# EAGLE design MICROCONTROLLER_SAI (EAGLE 9.6.2)
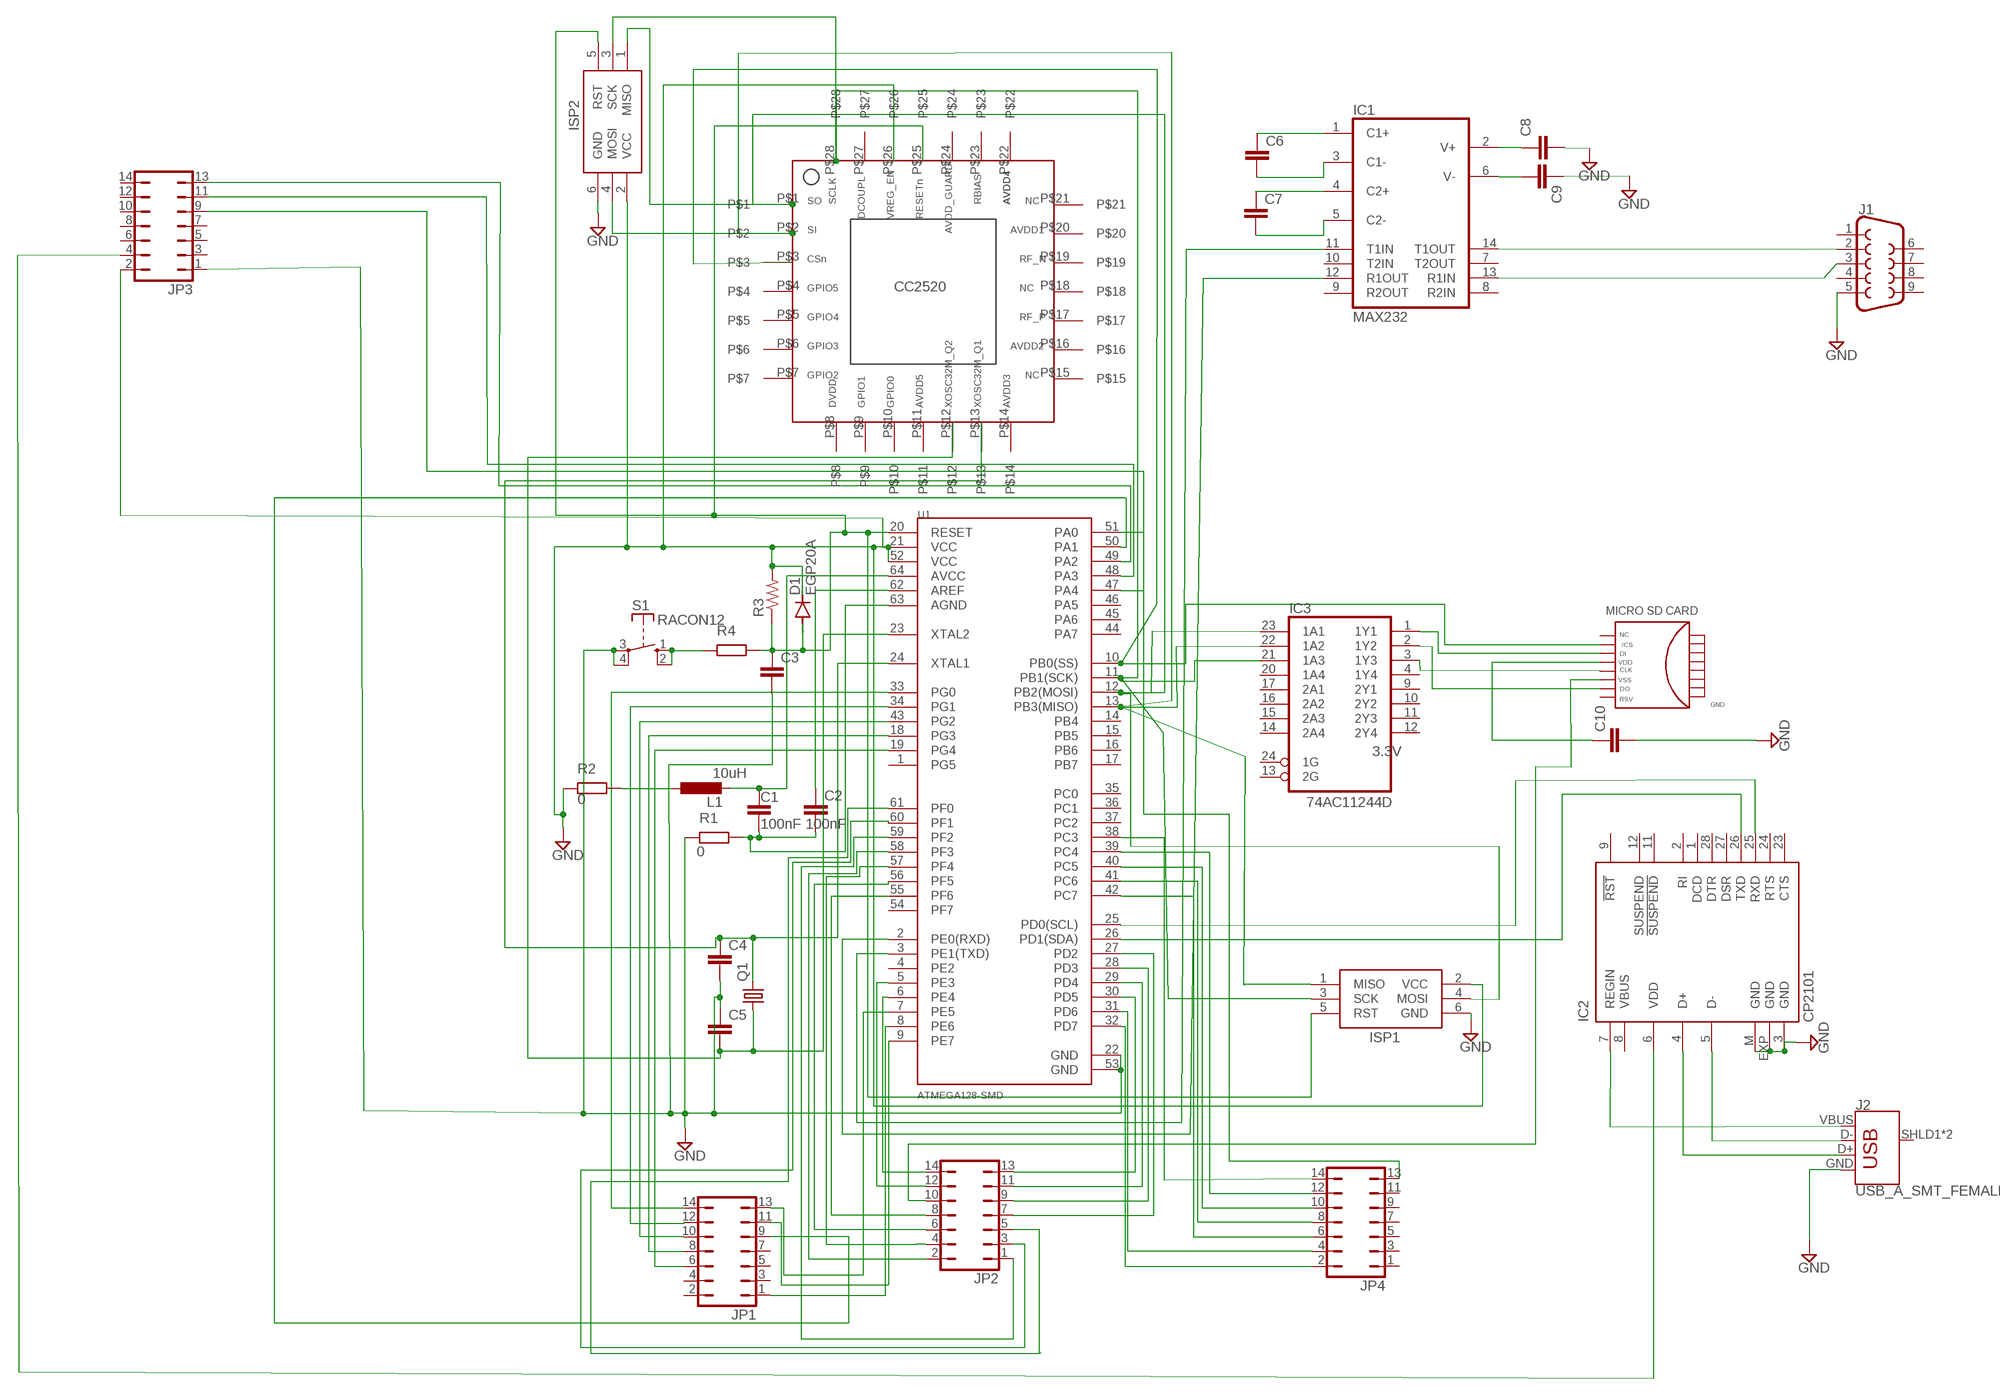
[diagram p0: schematic, sheet 1]

## Parts
C1  C2,5-3  [C2.5-3]
C2  C2,5-3  [C2.5-3]
C3  C7.5/3  [C7.5B3]
C4  C2,5-3  [C2.5-3]
C5  C2,5-3  [C2.5-3]
C6  C7.5/3  [C7.5B3]
C7  C7.5/3  [C7.5B3]
C8  C7.5/3  [C7.5B3]
C9  C7.5/3  [C7.5B3]
C10  C7.5/3  [C7.5B3]
D1  EGP20A  [DO15-12]
IC1  MAX232  [DIL16]
IC2  CP2101  [MLP28]
IC3  74AC11244D  [SO24W]
ISP1  AVRISP-6  [AVRISP]
ISP2  AVRISP-6  [AVRISP]
J1  DB9FEMALE  [DB9]
J2  USB_A_SMT_FEMALE  [USB-A-S-SILK-FEMALE]
JP1  JP7Q  [JP7Q]
JP2  JP7Q  [JP7Q]
JP3  JP7Q  [JP7Q]
JP4  JP7Q  [JP7Q]
L1  L-EU0204/5  [0204/5]
Q1  CRYSTALHC49U-V  [HC49U-V]
R1  R  (no package)
R2  R  (no package)
R3  R-US_VTA55  [VTA55]
R4  R  (no package)
S1  RACON12  [RACON12]
U1  ATMEGA128-SMD  [TQFP64_14X14MM]
U$1  SD-CARD  [SD-CARD]
U$2  CC2520  [CC2520]

## Nets
3.3V: C10.1 U$1.P$4
5V: C3.2 C4.2 C5.1 D1.C ISP1.2(VCC) ISP2.2(VCC) JP3.1 JP3.2 R1.1 R2.1 R3.2 S1.3(P) S1.4(P) U1.21(VCC) U1.22(GND) U1.52(VCC) U1.53(GND) U$2.P$26 ; supply symbol labelled GND
GND: C8.2 C9.1 C10.2 IC2.3(GND) IC2.EXP(GND) IC2.M(GND) ISP1.6(GND) ISP2.6(GND) J1.5 J2.GND
N$1: C2.1 U1.62(AREF)
N$2: C1.2 C2.2 R1.2 U1.63(AGND)
N$3: C1.1 L1.2 U1.64(AVCC)
N$4: L1.1 R2.2
N$5: R4.1 S1.1(S) S1.2(S)
N$6: C6.1 IC1.1(C1+)
N$7: U1.10(PB0(SS)) U$1.P$2 U$2.P$3
N$8: C4.1 Q1.2 U1.24(XTAL1) U$2.P$13
N$9: C5.2 Q1.1 U1.23(XTAL2) U$2.P$12
N$10: IC3.22(1A2) ISP1.1(MISO) ISP2.4(MOSI) U1.13(PB3(MISO)) U$2.P$2
N$11: IC3.23(1A1) ISP1.4(MOSI) ISP2.1(MISO) U1.12(PB2(MOSI)) U$2.P$1
N$12: IC3.21(1A3) ISP1.3(SCK) ISP2.3(SCK) U1.11(PB1(SCK)) U$2.P$28
N$13: C9.2 IC1.6(V-)
N$14: C8.1 IC1.2(V+)
N$15: C7.1 IC1.4(C2+)
N$16: C6.2 IC1.3(C1-)
N$17: C7.2 IC1.5(C2-)
N$18: IC2.25(RXD) U1.25(PD0(SCL))
N$19: IC1.11(T1IN) U1.3(PE1(TXD))
N$20: IC1.12(R1OUT) U1.2(PE0(RXD))
N$21: IC3.3(1Y3) U$1.P$5
N$22: JP2.5 U1.61(PF0)
N$23: IC2.5(D-) J2.D-
N$24: JP2.3 U1.60(PF1)
N$25: IC2.4(D+) J2.D+
N$26: IC2.7(REGIN) J2.VBUS
N$27: IC1.14(T1OUT) J1.2
N$28: IC1.13(R1IN) J1.3
N$29: C3.1 D1.A ISP1.5(RST) ISP2.5(RST) R3.1 R4.2 U1.20(RESET) U$2.P$25
N$30: IC2.26(TXD) U1.26(PD1(SDA))
N$31: IC3.1(1Y1) U$1.P$3
N$32: IC3.2(1Y2) U$1.P$7
N$33: JP2.12 U1.5(PE3)
N$34: JP2.14 U1.6(PE4)
N$35: JP4.2 U1.32(PD7)
N$36: JP4.4 U1.31(PD6)
N$37: JP4.12 U1.39(PC4)
N$38: JP4.10 U1.40(PC5)
N$39: JP4.8 U1.41(PC6)
N$40: JP4.6 U1.42(PC7)
N$41: JP4.13 U1.51(PA0)
N$42: JP1.11 U1.9(PE7)
N$43: JP1.1 U1.8(PE6)
N$44: JP1.13 U1.7(PE5)
N$45: JP1.9 U1.50(PA1)
N$46: JP4.14 U1.38(PC3)
N$48: JP1.14 U1.33(PG0)
N$49: JP1.12 U1.34(PG1)
N$50: JP1.10 U1.43(PG2)
N$51: JP1.8 U1.18(PG3)
N$52: JP1.6 U1.19(PG4)
N$53: JP2.13 U1.30(PD5)
N$54: JP2.11 U1.29(PD4)
N$55: JP2.9 U1.28(PD3)
N$56: JP2.7 U1.27(PD2)
N$57: JP2.1 U1.59(PF2)
N$58: JP2.2 U1.58(PF3)
N$59: JP2.4 U1.57(PF4)
N$60: JP2.6 U1.56(PF5)
N$61: JP2.8 U1.55(PF6)
N$62: JP2.10 U$1.P$6
N$63: JP3.13 U1.49(PA2)
N$64: JP3.11 U1.48(PA3)
N$65: JP3.9 U1.47(PA4)
N$67: IC2.6(VDD) JP3.4
Unconnected: IC1.7(T2OUT) IC1.8(R2IN) IC1.9(R2OUT) IC1.10(T2IN) IC2.1(DCD) IC2.2(RI) IC2.8(VBUS) IC2.9(!RST) IC2.11(!SUSPEND) IC2.12(SUSPEND) IC2.23(CTS) IC2.24(RTS) IC2.27(DSR) IC2.28(DTR) IC3.4(1Y4) IC3.9(2Y1) IC3.10(2Y2) IC3.11(2Y3) IC3.12(2Y4) IC3.13(2G) IC3.14(2A4) IC3.15(2A3) IC3.16(2A2) IC3.17(2A1) IC3.20(1A4) IC3.24(1G) J1.1 J1.4 J1.6 J1.7 J1.8 J1.9 J2.SHLD1(SHIELD) J2.SHLD2(SHIELD) JP1.2 JP1.3 JP1.4 JP1.5 JP1.7 JP3.3 JP3.5 JP3.6 JP3.7 JP3.8 JP3.10 JP3.12 JP3.14 JP4.1 JP4.3 JP4.5 JP4.7 JP4.9 JP4.11 U1.1(PG5) U1.4(PE2) U1.14(PB4) U1.15(PB5) U1.16(PB6) U1.17(PB7) U1.35(PC0) U1.36(PC1) U1.37(PC2) U1.44(PA7) U1.45(PA6) U1.46(PA5) U1.54(PF7) U$1.P$1 U$1.P$8 U$1.P$9 U$1.P$10 U$1.P$11 U$1.P$12 U$1.P$13 U$1.P$14 U$1.P$15 U$1.P$16 U$2.P$4 U$2.P$5 U$2.P$6 U$2.P$7 U$2.P$8 U$2.P$9 U$2.P$10 U$2.P$11 U$2.P$14 U$2.P$15 U$2.P$16 U$2.P$17 U$2.P$18 U$2.P$19 U$2.P$20 U$2.P$21 U$2.P$22 U$2.P$23 U$2.P$24 U$2.P$27

## Notes on the sheet
- 10uH
- 0
- 100nF | 100nF
- 0

## Power pins joined to a net without a drawn wire
5V: IC1.15(GND) IC3.5(GND) IC3.6(GND) IC3.7(GND) IC3.8(GND)
VCC: IC1.16(VCC) IC3.18(VCC) IC3.19(VCC)

## Library data of the parts
C1-C10 = capacitor-wima:C: CAPACITOR naming: grid - package width
D1 = diode:EGP20A: DIODE ultra fast-recovery rectifier
IC1 = maxim:MAX232: RS232 TRANSCEIVER; MF: MAXIM; MPN: MAX232ACPE+; OC_FARNELL: 9723773; OC_NEWARK: 68K4544
IC2 = silabs:CP210*: Single-Chip USB to UART Bridge Source: www.silabs.com .. CP2101.pdf / cp2102.pdf; MF: FARNELL; MPN: CP2102-GM; OC_FARNELL: 9282130; OC_NEWARK: 30K5635
IC3 = 74ac-logic:74AC11244: Octal BUFFER/DRIVER
ISP1 ISP2 = adafruit:AVRISP: AVR ISP HEADER Standard 6 pin header for AVR programming
J1 = SparkFun-Connectors:DB9: DB9 Connector Standard DB9 (D-Sub 9) serial connector. Can be used for CAN bus as well as RS485 and RS232. Footprint production proven. Here is the female version connector we sell at SparkFun: 9 Pin Female Serial Connector - PCB Mount <https://www.sparkfun.com/products/429> (PRT-00429) This connector has been used on the following SparkFun products: SparkFun RS232 Shifter - SMD <https://www.sparkfun.com/products/449> (PRT-00449) SparkFun RS232 Shifter SMD (No DB9) <https://www.sparkfun.com/products/8780> (PRT-08780); PROD_ID: CONN-08194
J2 = SparkFun-Connectors:USB_A: USB-A Connector Male and female variants, as well as PTH and SMT variants SparkFun Products: SparkFun XBee Explorer Dongle <https://www.sparkfun.com/products/11697> PTH Male SparkFun MicroView-USB Programmer <https://www.sparkfun.com/products/12924> SMT Male SparkFun USB Type A Female Breakout <https://www.sparkfun.com/products/12700> SMT Female; PROD_ID: CONN-09520; SF_ID: PRT-09011
JP1-JP4 = jumper:JP7Q: JUMPER
L1 = rcl:L-EU: INDUCTOR, European symbol; SPICEPREFIX: L
Q1 = crystal:CRYSTAL: CRYSTAL; OC_FARNELL: 1666969; OC_NEWARK: unknown
R1 R2 R4 = ngspice-simulation:R: RESISTOR
R3 = rcl:R-US_: RESISTOR, American symbol; SPICEPREFIX: R
S1 = switch-misc:RACON12: ITT SWITCH
U1 = SparkFun-IC-Microcontroller:ATMEGA128: ATmega 128 ATmega128/128L/1281/2561. Note: The ATmega128 pin 1 is PEN and the ATmega256/1281 pin 1 is PG5. Not in catalog
U$1 = SD-CARD:SD-CARD
U$2 = CC2520:CC2520

## Board
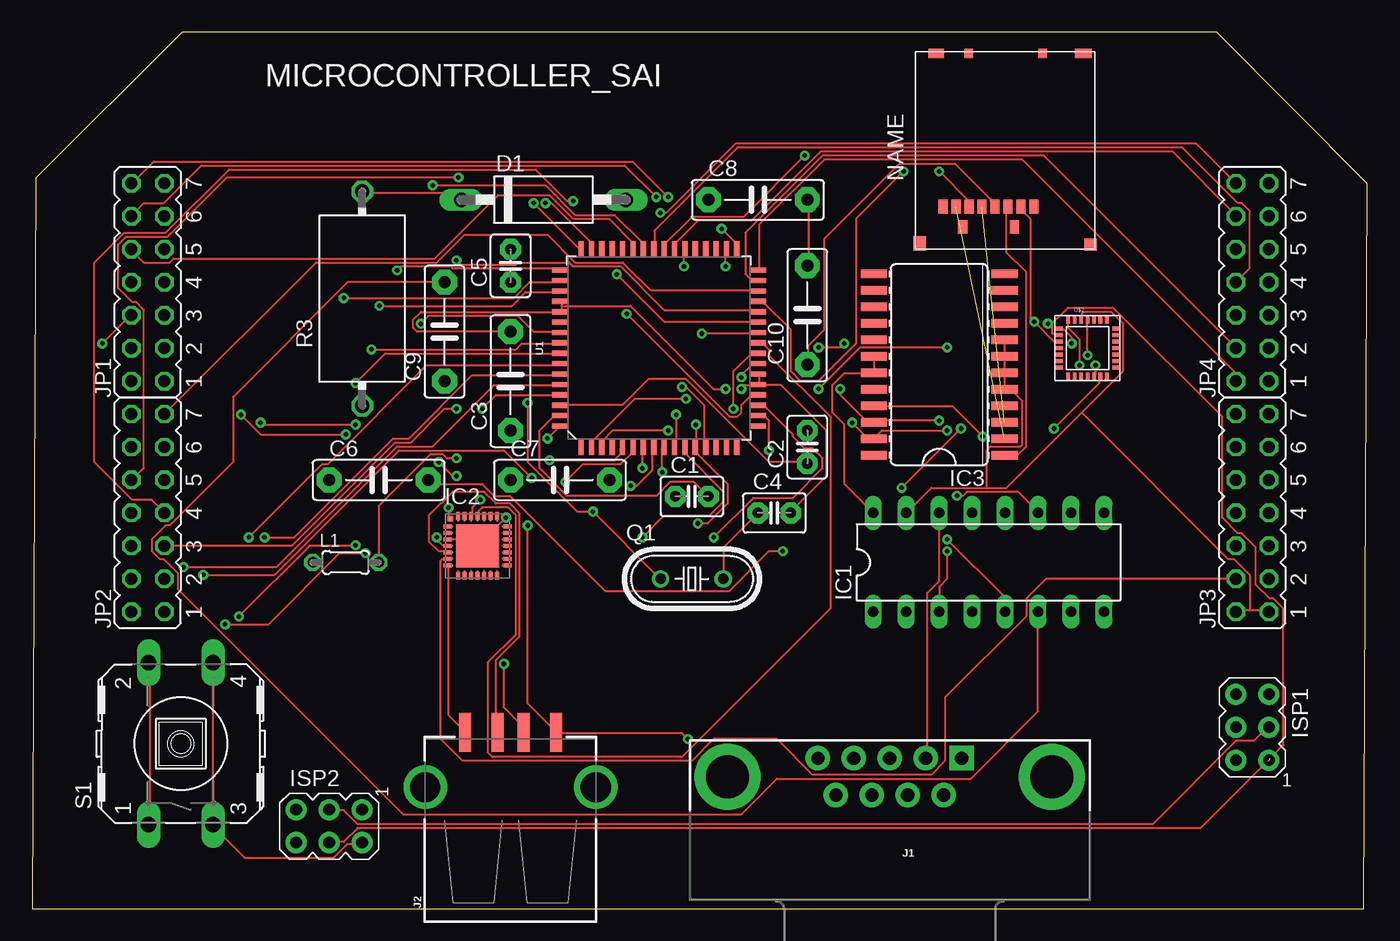
[diagram p1: board, top side]
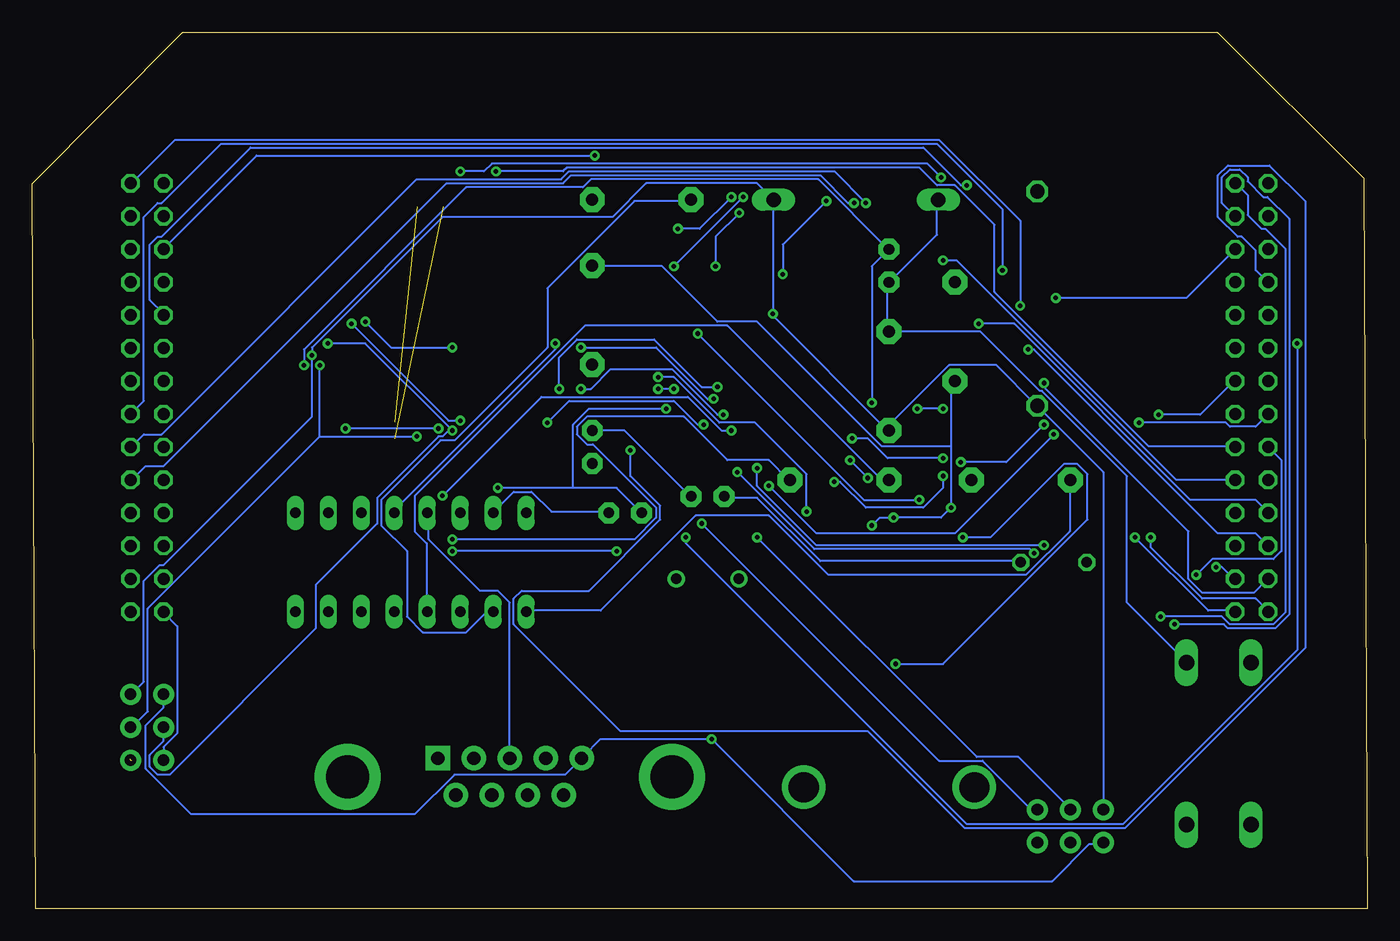
[diagram p2: board, bottom side, seen from below]

Size 102.81 x 67.5 mm. Coordinates in mm from the lower left corner, seen from the top.
Outline: 0,0 102.54,0 102.81,55.86 91.22,67.5 11.53,67.5 0.27,56.29 0,0
Copper layers (1*16): Top 0.035mm / dielectric 1.5mm / Bottom 0.035mm
Design rules "default": minimum track width 6mil, minimum drill 0.35mm, track to track 6mil, track to pad 6mil, pad to pad 6mil, via to via 6mil, smd to smd 6mil, copper to edge 40mil, drill to drill 6mil, minimum pad ring 10mil, minimum via ring 8mil, stop-mask expansion 4mil, vias tented up to drill 0mil, thermal gap 10mil

### Footprints (pad centres in the part's own frame; a part is rotated, then mirrored left to right if it is on the bottom)
C2.5-3 = drill 0.813 pad 1.6 octagon: 1 -1.27,0; 2 1.27,0
C7.5B3 = drill 0.914 pad 1.905 octagon: 1 -3.81,0; 2 3.81,0
DO15-12 = drill 1.118 long: A 6.35,0; C -6.35,0
DIL16 = drill 0.813 long: 1 -8.89,-3.81; 2 -6.35,-3.81; 3 -3.81,-3.81; 4 -1.27,-3.81; 5 1.27,-3.81; 6 3.81,-3.81; 7 6.35,-3.81; 8 8.89,-3.81; 9 8.89,3.81; 10 6.35,3.81; 11 3.81,3.81; 12 1.27,3.81; 13 -1.27,3.81; 14 -3.81,3.81; 15 -6.35,3.81; 16 -8.89,3.81
MLP28 = smd 0.6 x 0.3: 1 -2.3,1.5; 2 -2.3,1; 3 -2.3,0.5; 4 -2.3,0; 5 -2.3,-0.5; 6 -2.3,-1; 7 -2.3,-1.5; 15 2.3,-1.5; 16 2.3,-1; 17 2.3,-0.5; 18 2.3,0; 19 2.3,0.5; 20 2.3,1; 21 2.3,1.5 | smd 0.3 x 0.6: 8 -1.5,-2.3; 9 -1,-2.3; 10 -0.5,-2.3; 11 0,-2.3; 12 0.5,-2.3; 13 1,-2.3; 14 1.5,-2.3; 22 1.5,2.3; 23 1,2.3; 24 0.5,2.3; 25 0,2.3; 26 -0.5,2.3; 27 -1,2.3; 28 -1.5,2.3 | smd 3.3 x 3.3: EXP 0,0 | smd 0.435 x 0.435: M -2.103,2.103
SO24W = smd 0.66 x 2.032: 1 -6.985,-5.029; 2 -5.715,-5.029; 3 -4.445,-5.029; 4 -3.175,-5.029; 5 -1.905,-5.029; 6 -0.635,-5.029; 7 0.635,-5.029; 8 1.905,-5.029; 9 3.175,-5.029; 10 4.445,-5.029; 11 5.715,-5.029; 12 6.985,-5.029; 13 6.985,5.029; 14 5.715,5.029; 15 4.445,5.029; 16 3.175,5.029; 17 1.905,5.029; 18 0.635,5.029; 19 -0.635,5.029; 20 -1.905,5.029; 21 -3.175,5.029; 22 -4.445,5.029; 23 -5.715,5.029; 24 -6.985,5.029
AVRISP = drill 0.9 pad 1.626: 1 -1.27,2.54; 2 1.27,2.54; 3 -1.27,0; 4 1.27,0; 5 -1.27,-2.54; 6 1.27,-2.54
DB9 = drill 1.016 pad 1.88 square: 1 -5.54,-1.42 | drill 1.016 pad 1.88: 2 -2.77,-1.42; 3 0,-1.42; 4 2.77,-1.42; 5 5.54,-1.42; 6 -4.15,1.42; 7 -1.38,1.42; 8 1.38,1.42; 9 4.15,1.42 | drill 3.302 pad 5.08: G1 -12.5,0; G2 12.5,0
USB-A-S-SILK-FEMALE = smd 3 x 0.9: D+ 7.212,-1; D- 7.212,1; GND 7.212,-3.5; VBUS 7.212,3.5 | drill 2.311: SHLD1 3,-6.566; SHLD2 3,6.566
JP7Q = drill 0.914 octagon: 1 -7.62,-1.27; 2 -7.62,1.27; 3 -5.08,-1.27; 4 -5.08,1.27; 5 -2.54,-1.27; 6 -2.54,1.27; 7 0,-1.27; 8 0,1.27; 9 2.54,-1.27; 10 2.54,1.27; 11 5.08,-1.27; 12 5.08,1.27; 13 7.62,-1.27; 14 7.62,1.27
0204/5 = drill 0.813 octagon: 1 -2.54,0; 2 2.54,0
HC49U-V = drill 0.813: 1 -2.413,0; 2 2.413,0
VTA55 = drill 1.1 octagon: 1 -8.255,0; 2 8.255,0
RACON12 = drill 1.194 long: 1 -6.248,2.489; 2 6.248,2.489; 3 -6.248,-2.489; 4 6.248,-2.489
TQFP64_14X14MM = smd 0.4 x 1.27: 1 -6,-7.6; 2 -5.2,-7.6; 3 -4.4,-7.6; 4 -3.6,-7.6; 5 -2.8,-7.6; 6 -2,-7.6; 7 -1.2,-7.6; 8 -0.4,-7.6; 9 0.4,-7.6; 10 1.2,-7.6; 11 2,-7.6; 12 2.8,-7.6; 13 3.6,-7.6; 14 4.4,-7.6; 15 5.2,-7.6; 16 6,-7.6; 33 6,7.6; 34 5.2,7.6; 35 4.4,7.6; 36 3.6,7.6; 37 2.8,7.6; 38 2,7.6; 39 1.2,7.6; 40 0.4,7.6; 41 -0.4,7.6; 42 -1.2,7.6; 43 -2,7.6; 44 -2.8,7.6; 45 -3.6,7.6; 46 -4.4,7.6; 47 -5.2,7.6; 48 -6,7.6 | smd 1.27 x 0.4: 17 7.6,-6; 18 7.6,-5.2; 19 7.6,-4.4; 20 7.6,-3.6; 21 7.6,-2.8; 22 7.6,-2; 23 7.6,-1.2; 24 7.6,-0.4; 25 7.6,0.4; 26 7.6,1.2; 27 7.6,2; 28 7.6,2.8; 29 7.6,3.6; 30 7.6,4.4; 31 7.6,5.2; 32 7.6,6; 49 -7.6,6; 50 -7.6,5.2; 51 -7.6,4.4; 52 -7.6,3.6; 53 -7.6,2.8; 54 -7.6,2; 55 -7.6,1.2; 56 -7.6,0.4; 57 -7.6,-0.4; 58 -7.6,-1.2; 59 -7.6,-2; 60 -7.6,-2.8; 61 -7.6,-3.6; 62 -7.6,-4.4; 63 -7.6,-5.2; 64 -7.6,-6
SD-CARD = smd 0.7 x 1.05: P$1 2.225,3.275; P$2 1.225,3.275; P$3 0.225,3.275; P$4 -0.775,3.275; P$5 -1.775,3.275; P$6 -2.775,3.275; P$7 -3.775,3.275; P$8 -4.775,3.275; P$9 0.725,1.725; P$10 -3.275,1.725 | smd 0.95 x 1.1: P$11 -6.575,0.45 | smd 0.95 x 0.9: P$12 6.575,0.35 | smd 1.2 x 0.75: P$13 -5.325,15.075 | smd 1.3 x 0.75: P$14 6.025,15.075 | smd 0.65 x 0.75: P$15 2.875,15.075; P$16 -2.825,15.075
CC2520 = smd 0.6 x 0.3: P$1 -2.2,1.5; P$2 -2.2,1; P$3 -2.2,0.5; P$4 -2.2,0; P$5 -2.2,-0.5; P$6 -2.2,-1; P$7 -2.2,-1.5; P$15 2.2,-1.5; P$16 2.2,-1; P$17 2.2,-0.5; P$18 2.2,0; P$19 2.2,0.5; P$20 2.2,1; P$21 2.2,1.5 | smd 0.3 x 0.6: P$8 -1.5,-2.2; P$9 -1,-2.2; P$10 -0.5,-2.2; P$11 0,-2.2; P$12 0.5,-2.2; P$13 1,-2.2; P$14 1.5,-2.2; P$22 1.5,2.2; P$23 1,2.2; P$24 0.5,2.2; P$25 0,2.2; P$26 -0.5,2.2; P$27 -1,2.2; P$28 -1.5,2.2

### Placement (x,y rotation side)
C1  50.8,31.75 0 top
C2  59.69,35.56 90 top
C3  36.83,40.64 90 top
C4  57.15,30.48 0 top
C5  36.83,49.53 90 top
C6  26.67,33.02 0 top
C7  40.64,33.02 0 top
C8  55.88,54.61 0 top
C9  31.75,44.45 90 top
C10  59.69,45.72 90 top
D1  39.37,54.61 0 top
IC1  73.66,26.67 0 top
IC2  34.29,27.94 0 top
IC3  69.85,41.91 90 top
ISP1  93.98,13.97 180 top
ISP2  22.86,6.35 270 top
J1  66.04,10.16 180 top
J2  36.83,6.35 90 top
JP1  8.89,48.26 90 top
JP2  8.89,30.48 90 top
JP3  93.98,30.48 90 top
JP4  93.98,48.26 90 top
L1  24.13,26.67 0 top
Q1  50.8,25.4 0 top
R3  25.4,46.99 90 top
S1  11.43,12.7 90 top
U1  48.26,43.18 0 top
U$1  74.93,50.8 0 top
U$2  81.28,43.18 0 top

### Tracks (layer width: path | path; a pad name or v marks a point on that pad's centre or on a via)
3.3V
  Top 0.152: U$1.P$4 74.12,54.2 73.81,54.51 73.81,54.66 71.07,57.4 66.8,57.4 61.01,51.61 61.01,44.6 59.79,43.38 59.79,42.01 C10.1
5V  (via drill 0.35)
  Top 0.152: 93.78,22.96 95.15,22.96 JP3.1 | 93.78,22.96 92.71,22.96 JP3.2 | U1.21 55.98,40.49 55.98,41.1 U1.22 | U1.21 55.98,40.33 57.66,40.33 61.16,36.83 61.16,33.32 58.42,30.58 C4.2 | IC3.8 IC3.7 IC3.6 IC3.5 74.88,39.88 75.49,39.88 76.25,39.12 76.25,35.76 76.1,35.61 73.81,35.61 73.51,35.31 73.51,32.41 | 80.82,38.2 75.03,32.41 73.51,32.41 | 80.82,38.2 84.02,41.4 84.02,45.06 83.11,45.97 80.97,45.97 80.82,45.82 80.82,45.52 U$2.P$26 | 73.51,32.41 69.24,32.41 IC1.15 | 93.78,22.96 93.78,25.71 92.56,26.92 92.1,26.92 80.82,38.2 | D1.C 32.51,55.12 25.5,55.12 R3.2 | 40.74,46.43 40.74,46.74 U1.52 | 40.74,46.43 40.74,46.13 U1.53 40.59,45.97 29.92,45.97 29.31,45.36 29.31,44.75 29.62,44.45 C3.2 | ISP2.2 25.35,4.98 24.28,4.98 23.22,3.91 16.36,3.91 13.92,6.35 S1.3 S1.4 | v54.61,40.03 54.91,40.33 55.83,40.33 U1.21 | v53.39,40.03 52.48,40.03 46.08,46.43 40.74,46.43
  Bottom 0.152: ISP1.2 92.71,12.45 91.64,13.51 91.64,21.74 92.71,22.81 JP3.2 | C4.2 58.42,30.58 62.84,30.58 64.36,32.11 65.73,32.11 67.26,30.58 IC1.15 | D1.C 33.12,54.51 33.12,51.92 36.78,48.26 C5.1 36.93,48.26 36.93,44.45 C3.2 29.77,44.45 25.2,39.88 25.04,39.88 18.49,33.32 18.49,23.57 13.92,19 S1.4 | v53.39,40.03 v54.61,40.03
GND  (via drill 0.35)
  Top 0.152: C10.2 59.79,49.63 59.79,54.51 C8.2 | IC2.3 32.05,28.45 33.73,28.45 34.19,27.99 IC2.EXP v36.47,30.12 | v32.05,30.89 32.05,30.12 IC2.M | v50.49,13.06 50.04,13.51 40.44,13.51 J2.GND 40.28,13.67 38.15,15.8 v38.15,29.52
  Bottom 0.152: 32.05,35.61 32.05,40.33 C9.1 | 32.05,35.61 v32.05,30.89 32.82,30.12 v36.47,30.12 37.54,30.12 v38.15,29.52 | 32.05,35.61 37.39,35.61 46.99,45.21 50.04,45.21 54.3,49.48 59.64,49.48 C10.2 | ISP2.6 20.32,4.98 21.39,4.98 24.25,2.11 39.55,2.11 v50.49,13.06 59.03,13.06 60.4,11.68 J1.5 60.55,11.53 61.77,10.31 70.31,10.31 73.35,7.26 90.58,7.26 94.08,10.77 94.08,14.12 92.71,15.49 ISP1.6
N$1
  Top 0.152: U1.62 40.74,38.81 45.47,38.81 47.45,40.79 50.34,40.79 56.74,34.39 59.64,34.39 C2.1
N$2
  Top 0.152: C1.2 50.95,32.87 49.12,32.87 48.06,31.8 41.2,31.8 39.06,33.93 39.06,36.83 40.13,37.9 40.59,37.9 U1.63
  Bottom 0.152: C2.2 57.2,36.83 52.17,31.8 C1.2
N$3  (via drill 0.35)
  Top 0.152: v39.68,36.22 40.59,37.13 U1.64 | v32.66,34.7 31.9,34.7 31.6,35 30.68,35 26.72,31.04 26.72,26.77 L1.2
  Bottom 0.152: v39.68,36.22 38.46,36.22 36.93,34.7 v32.66,34.7 | C1.1 49.43,31.65 46.99,31.65 42.11,26.77 26.72,26.77 L1.2
N$5
  Top 0.152: S1.1 9.04,6.5 9.04,18.85 S1.2
N$6
  Bottom 0.152: IC1.1 64.67,22.96 59.03,22.96 51.71,30.28 46.08,30.28 41.5,25.71 26.26,25.71 22.91,29.06 22.91,33.02 C6.1
N$7  (via drill 0.35)
  Top 0.152: U$2.P$3 78.99,43.69 78.69,43.69 v77.16,45.21 76.86,45.52 76.86,53.14 76.25,53.75 76.25,54.05 U$1.P$2 | v49.58,38.05 49.58,35.61 U1.10 | v60.55,40.03 63.75,43.23 v70.46,43.23
  Bottom 0.152: v49.58,38.05 50.04,38.05 53.54,41.55 58.27,41.55 59.79,40.03 v60.55,40.03 | v70.46,43.23 75.18,43.23 v77.16,45.21
N$8  (via drill 0.35)
  Top 0.152: v78.69,36.98 82.19,40.49 82.19,40.95 U$2.P$13 | v66.95,32.41 v71.53,36.98 | v54,38.51 54,41.4 55.37,42.77 55.83,42.77 U1.24 | C4.1 53.24,27.84 53.24,25.4 Q1.2
  Bottom 0.152: v71.53,36.98 v78.69,36.98 | 61.16,32.41 57.81,32.41 C4.1 | 61.16,32.41 v66.95,32.41 | v54,38.51 59.94,38.51 61.16,37.29 61.16,32.41
N$9  (via drill 0.35)
  Top 0.152: v54.61,40.95 54.61,41.1 55.37,41.86 55.83,41.86 U1.23 | Q1.1 48.36,25.4 v43.18,30.58 41.96,30.58 38.15,34.39 v38.15,38.96 | v81.89,41.86 81.89,41.1 U$2.P$12
  Bottom 0.152: v54.61,40.95 53.39,40.95 49.89,37.44 47.14,37.44 43.18,33.48 v43.18,30.58 | v81.89,41.86 81.89,43.08 69.39,55.57 60.4,55.57 59.79,56.18 42.27,56.18 36.93,50.85 C5.2 38.15,49.48 v38.15,38.96
N$10  (via drill 0.35)  (2 unrouted)
  Top 0.152: v50.04,40.18 50.34,40.18 51.71,38.81 51.71,35.61 U1.13 | v62.23,40.03 62.23,39.57 64.21,37.59 64.82,37.59 | 78.54,45.06 78.54,44.3 78.99,44.3 U$2.P$2 | 78.54,45.06 79.76,46.28 83.26,46.28 91.64,37.9 91.64,30.12 92.86,28.91 93.17,28.91 94.23,27.84 94.23,24.94 95.3,23.88 95.61,23.88 96.37,23.11 96.37,12.6 95.3,11.53 | 95.15,11.38 89.97,6.2 25.04,6.2 23.98,5.13 22.91,5.13 ISP2.4 | v69.85,37.59 64.82,37.59 | 78.54,45.06 v78.23,45.06 | 64.82,37.59 IC3.22
  Bottom 0.152: v50.04,40.18 51.26,40.18 54.91,43.84 60.86,43.84 62.23,42.47 v62.23,40.03 | v69.85,37.59 70.76,37.59 v78.23,45.06
N$11  (via drill 0.35)
  Top 0.152: v80.06,43.54 80.06,43.99 79.45,44.6 79.15,44.6 U$2.P$1 | v70.46,36.83 65.43,36.83 64.82,36.22 | v51.11,37.29 51.11,35.61 U1.12 51.11,35.46 51.11,35.15 53.54,32.71 53.54,31.19 52.02,29.67 v51.26,29.67 | v63.14,37.44 64.36,36.22 64.82,36.22 | 64.82,36.22 IC3.23
  Bottom 0.152: v80.06,43.54 77.16,43.54 70.61,36.98 | v51.11,37.29 51.56,37.29 53.39,39.12 61.47,39.12 v63.14,37.44 | v51.26,29.67 32.97,11.38 29.62,11.38 25.96,7.72 25.5,7.72 ISP2.1 | ISP1.4 92.71,12.9 93.78,11.84 93.78,10.92 93.17,10.31 92.25,10.31 80.97,21.59 80.97,24.94 76.25,29.67 76.25,31.65 71.53,36.37 71.22,36.37 70.61,36.98 | 70.61,36.98 v70.46,36.83
N$12  (via drill 0.35)
  Top 0.152: v46.99,28.6 48.67,30.28 52.17,30.28 53.24,31.34 53.24,32.11 50.34,35 50.34,35.46 U1.11 | v80.67,41.86 80.67,43.84 79.76,44.75 79.76,45.36 U$2.P$28 | v73.2,36.37 70.92,38.66 64.82,38.66 IC3.21 | ISP2.3 22.91,7.57 23.98,7.57 25.04,6.5 86.31,6.5 92.71,12.9 94.08,12.9 95.15,13.97 ISP1.3
  Bottom 0.152: v46.99,28.6 30.07,11.68 26.87,11.68 22.91,7.72 ISP2.3 | 80.67,36.37 v80.67,41.86 | 80.67,36.37 93.93,23.11 93.93,15.19 95.15,13.97 ISP1.3 | 80.67,36.37 v73.2,36.37
N$13
  Top 0.152: IC1.6 77.47,15.19 72.29,10.01 57.35,10.01 54.61,7.26 28.55,7.26 11.18,24.64 11.18,25.86 10.11,26.92 9.8,26.92 9.2,27.53 9.2,28.45 10.26,29.52 10.57,29.52 15.44,34.39 15.44,39.42 24.28,48.26 C9.2
N$14
  Bottom 0.152: IC1.2 67.41,22.81 67.87,22.81 69.39,21.29 72.75,21.29 73.96,22.5 73.96,27.53 75.95,29.52 75.95,31.5 71.37,36.07 70.31,36.07 63.14,43.23 63.14,47.8 56.44,54.51 52.17,54.51 C8.1
N$15
  Bottom 0.152: C7.1 37.39,33.02 49.28,44.91 60.25,44.91 73.35,31.8 73.35,29.06 72.44,28.14 72.44,22.96 IC1.4
N$16  (via drill 0.35)
  Top 0.152: IC1.3 69.85,24.79 70.46,25.4 v70.46,27.53 | v57.81,27.53 56.74,27.53 53.7,24.49 44.09,24.49 36.78,31.8 35.56,31.8 34.65,32.71 30.84,32.71 30.53,33.02 C6.2
  Bottom 0.152: v57.81,27.53 v70.46,27.53
N$17  (via drill 0.35)
  Top 0.152: v70.46,28.45 74.88,24.03 74.88,22.96 IC1.5
  Bottom 0.152: v70.46,28.45 56.44,28.45 54.76,30.12 54.76,30.89 59.64,35.76 60.1,35.76 60.86,36.52 60.86,37.13 60.1,37.9 52.63,37.9 49.28,34.54 46.08,34.54 44.55,33.02 C7.2
N$18
  Top 0.152: IC2.25 34.34,30.28 34.34,30.58 34.65,30.89 36.63,30.89 37.24,30.28 37.24,21.13 35.1,19 35.1,11.99 35.41,11.68 50.04,11.68 61.47,23.11 61.47,37.9 56.74,42.62 56.74,43.08 56.29,43.54 55.98,43.54 U1.25
N$19  (via drill 0.35)
  Top 0.152: v48.97,36.83 44.7,36.83 43.94,36.07 43.94,35.61 U1.3 | v71.22,31.8 71.68,31.8 71.98,32.11 75.95,32.11 77.47,30.58 IC1.11
  Bottom 0.152: v48.97,36.83 49.73,36.83 52.32,39.42 63.6,39.42 v71.22,31.8
N$20  (via drill 0.35)
  Top 0.152: v50.34,39.27 46.38,39.27 43.18,36.07 43.18,35.61 U1.2 | v60.55,43.23 62.23,43.23 v62.54,43.54
  Bottom 0.152: v50.34,39.27 50.8,39.27 54.76,43.23 v60.55,43.23 | v62.54,43.54 62.54,43.08 75.03,30.58 IC1.12
N$21  (1 unrouted)
N$22  (via drill 0.35)
  Top 0.152: v34.65,38.51 35.71,39.57 40.59,39.57 U1.61 | v32.66,38.51 31.75,38.51 29.16,35.92 27.94,35.92 20.02,27.99 10.26,27.99 JP2.5
  Bottom 0.152: v32.66,38.51 v34.65,38.51
N$23
  Top 0.152: IC2.5 31.9,27.53 31.29,27.53 30.53,28.3 30.53,30.28 32.36,32.11 34.8,32.11 35.71,31.19 36.78,31.19 37.54,30.43 37.54,20.98 35.71,19.15 35.71,13.67 J2.D-
N$24  (via drill 0.35)
  Top 0.152: v11.63,26.31 18.8,26.31 28.09,35.61 30.84,35.61 35.56,40.33 40.59,40.33 U1.60
  Bottom 0.152: v11.63,26.31 11.18,26.31 10.26,25.4 JP2.3
N$25  (via drill 0.35)
  Top 0.152: v31.14,28.6 31.14,28.45 31.6,27.99 31.9,27.99 IC2.4 | v36.32,18.85 36.32,15.49 37.69,14.12 37.69,13.67 J2.D+
  Bottom 0.152: v31.14,28.6 29.01,28.6 23.37,34.24 22.3,34.24 21.54,33.48 21.54,29.97 32.66,18.85 v36.32,18.85
N$26
  Top 0.152: IC2.7 32.05,26.31 32.05,14.88 33.27,13.67 J2.VBUS
N$27
  Top 0.152: IC1.14 69.85,25.25 68.94,24.33 68.94,11.68 J1.2
N$28
  Bottom 0.152: J1.3 66.04,23.57 66.95,24.49 68.33,24.49 72.29,28.45 72.29,30.43 IC1.13
N$29  (via drill 0.35)
  Top 0.152: v81.28,42.62 U$2.P$25 | v45.77,45.82 53.7,37.9 54.3,37.9 54.61,38.2 54.61,38.81 55.37,39.57 55.83,39.57 U1.20
  Bottom 0.152: ISP1.5 95.15,16.56 94.23,17.48 94.23,25.25 93.02,26.47 92.71,26.47 81.28,37.9 v81.28,42.62 81.28,43.23 71.22,53.29 58.12,53.29 55.52,55.88 46.99,55.88 D1.A 45.77,54.51 v45.77,45.82 45.77,45.67 37.08,36.98 | 37.08,36.98 36.93,36.83 C3.1 37.08,36.98 | ISP2.5 20.32,33.63 25.35,38.66 R3.1 25.5,38.81 28.55,41.86 32.21,41.86 37.08,36.98
N$30  (via drill 0.35)
  Top 0.152: v34.49,31.5 33.88,30.89 33.88,30.28 IC2.26 | v51.56,44.3 55.83,44.3 U1.26
  Bottom 0.152: v34.49,31.5 38.76,31.5 v51.56,44.3
N$31
  Top 0.152: U$1.P$3 75.03,54.05 75.03,50.55 76.56,49.02 76.56,35.61 75.95,35 74.88,35 IC3.1
N$32  (1 unrouted)
N$33  (via drill 0.35)
  Top 0.152: v39.83,34.54 44.86,34.54 45.31,35 45.31,35.46 U1.5 | v38.46,33.17 36.32,35.31 28.25,35.31 18.64,25.71 v13.16,25.71
  Bottom 0.152: v38.46,33.17 v39.83,34.54 | v13.16,25.71 11.94,26.92 7.21,26.92 6.6,27.53 6.6,34.54 JP2.12
N$34  (via drill 0.35)
  Top 0.152: v41.05,32.87 42.42,34.24 45.31,34.24 46.23,35.15 46.23,35.46 U1.6 | v32.66,33.32 32.36,33.32 v31.29,34.39 | v24.89,37.29 17.73,37.29 v17.58,37.44
  Bottom 0.152: v41.05,32.87 40.59,32.87 38.61,30.89 34.19,30.89 32.66,32.41 v32.66,33.32 | v31.29,34.39 27.79,34.39 v24.89,37.29 | v17.58,37.44 10.87,37.44 10.57,37.13 8.59,37.13 JP2.14
N$35
  Top 0.152: JP4.2 92.71,41.25 76.25,57.71 61.01,57.71 55.98,52.68 55.98,49.33 U1.32
N$36
  Top 0.152: U1.31 55.83,48.41 55.37,48.41 54.91,48.87 54.91,52.07 60.86,58.01 77.93,58.01 92.71,43.23 JP4.4
N$37
  Top 0.152: U1.39 49.58,50.85 49.58,51.31 51.26,52.98 55.37,52.98 60.71,58.32 87.83,58.32 92.71,53.44 JP4.12
N$38  (via drill 0.35)
  Top 0.152: v59.49,58.01 54.76,53.29 50.8,53.29 48.67,51.16 48.67,50.85 U1.40
  Bottom 0.152: v59.49,58.01 85.55,58.01 92.71,50.85 JP4.10
N$39
  Top 0.152: JP4.8 93.78,49.33 93.78,53.75 93.17,54.36 92.86,54.36 88.59,58.62 54.3,58.62 47.9,52.22 47.9,50.85 U1.41
N$40  (via drill 0.35)
  Top 0.152: v30.84,55.73 39.52,55.73 41.81,53.44 44.86,53.44 46.99,51.31 46.99,50.85 U1.42
  Bottom 0.152: v30.84,55.73 31.29,55.73 34.19,58.62 86,58.62 92.86,51.76 93.17,51.76 93.78,51.16 93.78,46.89 92.71,45.82 JP4.6
N$41  (via drill 0.35)
  Top 0.152: v26.72,46.43 36.93,46.43 38,47.5 40.59,47.5 U1.51
  Bottom 0.152: v26.72,46.43 26.72,52.98 32.97,59.23 91.8,59.23 95.15,55.88 JP4.13
N$42  (via drill 0.35)
  Top 0.152: v48.51,33.63 48.51,35.46 U1.9 | v25.65,27.38 23.67,27.38 18.19,21.89 v14.83,21.89
  Bottom 0.152: v48.51,33.63 42.57,27.69 25.96,27.69 v25.65,27.38 | v14.83,21.89 11.02,21.89 10.72,21.59 7.06,21.59 5.99,22.66 5.99,53.14 7.67,54.81 7.98,54.81 9.2,56.03 9.2,56.34 9.8,56.95 10.57,56.95 11.18,56.34 11.18,54.36 JP1.11
N$43  (via drill 0.35)
  Top 0.152: v46.08,32.56 46.53,32.56 47.75,33.78 47.75,35.46 U1.8 | v24.13,36.52 17.58,36.52 v16.05,38.05
  Bottom 0.152: v46.08,32.56 42.42,28.91 31.75,28.91 v24.13,36.52 | v16.05,38.05 12.85,38.05 10.26,40.64 JP1.1
N$44  (via drill 0.35)
  Top 0.152: v46.99,33.93 46.99,35.46 U1.7 | v24.89,27.99 21.39,27.99 v15.9,22.5
  Bottom 0.152: v46.99,33.93 46.99,32.56 42.42,27.99 v24.89,27.99 | v15.9,22.5 11.18,22.5 10.57,21.89 7.21,21.89 6.3,22.81 6.3,50.85 7.82,52.38 8.13,52.38 9.2,53.44 9.2,54.97 10.11,55.88 JP1.13
N$45  (via drill 0.35)
  Top 0.152: v23.98,47.04 37.08,47.04 38.3,48.26 40.59,48.26 U1.50
  Bottom 0.152: v23.98,47.04 13.92,47.04 JP1.9
N$46  (via drill 0.35)
  Top 0.152: v50.19,49.48 50.19,50.7 U1.38 | v48.36,53.59 48.82,53.59 54.15,58.93 89.66,58.93 JP4.14
  Bottom 0.152: v50.19,49.48 50.19,51.76 v48.36,53.59
N$48  (via drill 0.35)
  Top 0.152: v53.09,52.38 54.15,51.31 54.15,50.85 U1.33 | v48.97,54.81 46.23,57.56 9.35,57.56 7.67,55.88 JP1.14
  Bottom 0.152: v53.09,52.38 51.41,52.38 v48.97,54.81
N$49  (via drill 0.35)
  Top 0.152: v53.39,49.48 53.39,50.7 U1.34 | v48.06,54.81 45.62,57.25 13,57.25 10.11,54.36 8.59,54.36 7.67,53.44 JP1.12
  Bottom 0.152: v48.06,54.81 v53.39,49.48
N$50
  Top 0.152: U1.43 46.23,50.85 46.23,51.31 44.4,53.14 41.66,53.14 39.83,54.97 35.87,54.97 30.99,50.09 10.87,50.09 10.57,49.78 8.59,49.78 7.67,50.7 JP1.10
N$51  (via drill 0.35)
  Top 0.152: v56.74,35.31 56.74,37.59 56.44,37.9 55.98,37.9 U1.18
  Bottom 0.152: v56.74,35.31 56.74,33.32 54.46,31.04 54.46,29.97 59.94,24.49 65.13,24.49 65.73,23.88 65.73,21.89 57.51,13.67 38.46,13.67 30.99,6.2 18.64,6.2 4.78,20.07 4.78,54.51 7.52,57.25 10.72,57.25 11.48,56.49 11.48,53.29 9.96,51.76 9.65,51.76 8.59,50.7 8.59,49.17 7.67,48.26 JP1.8
N$52  (via drill 0.35)
  Top 0.152: v52.48,28.6 55.52,31.65 58.57,31.65 60.86,33.93 60.86,34.7 60.1,35.46 59.49,35.46 58.57,36.37 58.57,36.52 56.44,38.66 55.98,38.66 U1.19 | v5.38,43.54 7.52,45.67 JP1.6
  Bottom 0.152: v52.48,28.6 52.48,28.14 30.84,6.5 18.8,6.5 5.38,19.91 v5.38,43.54
N$53
  Top 0.152: JP2.13 21.84,49.78 31.14,49.78 33.27,51.92 39.68,51.92 41.81,49.78 45.47,49.78 47.6,47.65 55.83,47.65 U1.30
N$54  (via drill 0.35)
  Top 0.152: v67.11,56.79 63.45,53.14 63.45,43.54 60.55,40.64 59.18,40.64 58.42,41.4 58.42,44.6 56.29,46.74 55.98,46.74 U1.29
  Bottom 0.152: v67.11,56.79 61.93,56.79 61.62,57.1 34.49,57.1 33.12,55.73 31.75,55.73 28.7,52.68 28.7,47.5 16.82,35.61 10.26,35.61 JP2.11
N$55  (via drill 0.35)
  Top 0.152: v32.66,49.94 32.97,49.63 37.24,49.63 37.39,49.78 41.35,49.78 41.66,49.48 45.31,49.48 48.67,46.13 55.83,46.13 U1.28
  Bottom 0.152: v32.66,49.94 31.6,49.94 14.68,33.02 JP2.9
N$56  (via drill 0.35)
  Top 0.152: v45.01,48.87 48.67,45.21 55.83,45.21 U1.27 | v41.66,54.51 41.2,54.51 38.76,56.95 15.14,56.95 10.26,52.07 7.06,52.07 4.78,49.78 4.78,34.39 7.67,31.5 9.2,31.5 10.11,30.58 JP2.7
  Bottom 0.152: v45.01,48.87 45.01,51.16 v41.66,54.51
N$57  (via drill 0.35)
  Top 0.152: v17.88,28.6 20.17,28.6 27.79,36.22 29.01,36.22 33.88,41.1 40.59,41.1 U1.59
  Bottom 0.152: v17.88,28.6 12.24,22.96 10.26,22.96 JP2.1
N$58  (via drill 0.35)
  Top 0.152: v16.66,28.6 22.3,34.24 22.76,34.24 30.38,41.86 40.59,41.86 U1.58
  Bottom 0.152: v16.66,28.6 16.66,27.84 12.7,23.88 8.59,23.88 7.67,22.96 JP2.2
N$59  (via drill 0.35)
  Top 0.152: v24.89,40.49 27.18,42.77 40.59,42.77 U1.57
  Bottom 0.152: v24.89,40.49 24.89,40.18 13.77,29.06 13.77,25.4 12.7,24.33 8.74,24.33 7.67,25.4 JP2.4
N$60  (via drill 0.35)
  Top 0.152: v26.11,43.08 37.24,43.08 37.69,43.54 40.59,43.54 U1.56
  Bottom 0.152: v26.11,43.08 25.65,43.08 11.48,28.91 8.59,28.91 JP2.6
N$61  (via drill 0.35)
  Top 0.152: v29.92,45.06 30.53,45.67 37.39,45.67 38.61,44.45 40.59,44.45 U1.55
  Bottom 0.152: v29.92,45.06 27.18,45.06 13.61,31.5 8.59,31.5 7.67,30.58 JP2.8
N$62  (via drill 0.35)
  Top 0.152: v69.85,56.79 72.14,54.51 72.14,54.2 U$1.P$6 | v32.82,56.34 14.99,56.34 10.41,51.76 7.21,51.76 6.6,51.16 6.6,47.8 7.67,46.74 7.98,46.74 8.59,46.13 8.59,33.93 7.67,33.02 JP2.10
  Bottom 0.152: v69.85,56.79 68.02,56.79 67.41,57.4 33.88,57.4 v32.82,56.34
N$63  (via drill 0.35)
  Top 0.152: v28.09,49.17 28.4,49.48 32.21,49.48 32.36,49.33 40.59,49.33 U1.49
  Bottom 0.152: v28.09,49.17 28.09,53.9 33.12,58.93 88.29,58.93 92.86,54.36 93.17,54.36 94.23,53.29 94.23,39.12 JP3.13
N$64  (via drill 0.35)
  Top 0.152: v38.61,54.36 42.11,50.85 U1.48
  Bottom 0.152: v38.61,54.36 41.05,56.79 61.47,56.79 62.08,56.18 73.2,56.18 92.86,36.52 94.23,36.52 95.15,35.61 JP3.11
N$65  (via drill 0.35)
  Top 0.152: v39.52,54.36 39.98,54.36 43.03,51.31 43.03,50.85 U1.47
  Bottom 0.152: v39.52,54.36 39.98,54.36 42.11,56.49 61.32,56.49 61.93,55.88 70.92,55.88 92.71,34.09 94.08,34.09 95.15,33.02 JP3.9
N$67
  Top 0.152: JP3.4 78.08,25.4 76.56,23.88 76.56,22.5 70.31,16.26 70.31,11.38 69.24,10.31 60.1,10.31 57.35,13.06 52.48,13.06 50.8,11.38 33.12,11.38 31.45,13.06 31.45,26.77 31.6,26.92 31.9,26.92 IC2.6
VCC
  Top 0.152: IC3.18 IC3.19 64.82,41.25 62.54,41.25 61.62,40.33 61.62,38.2 62.54,37.29 62.54,32.71 IC1.16
(copper drawn outside any net)
  shapes: Top area x1

### Text on the board
tPlace: MICROCONTROLLER_SAI